# Altium schematic sheet 201944AEP4P02.SchDoc
size A4
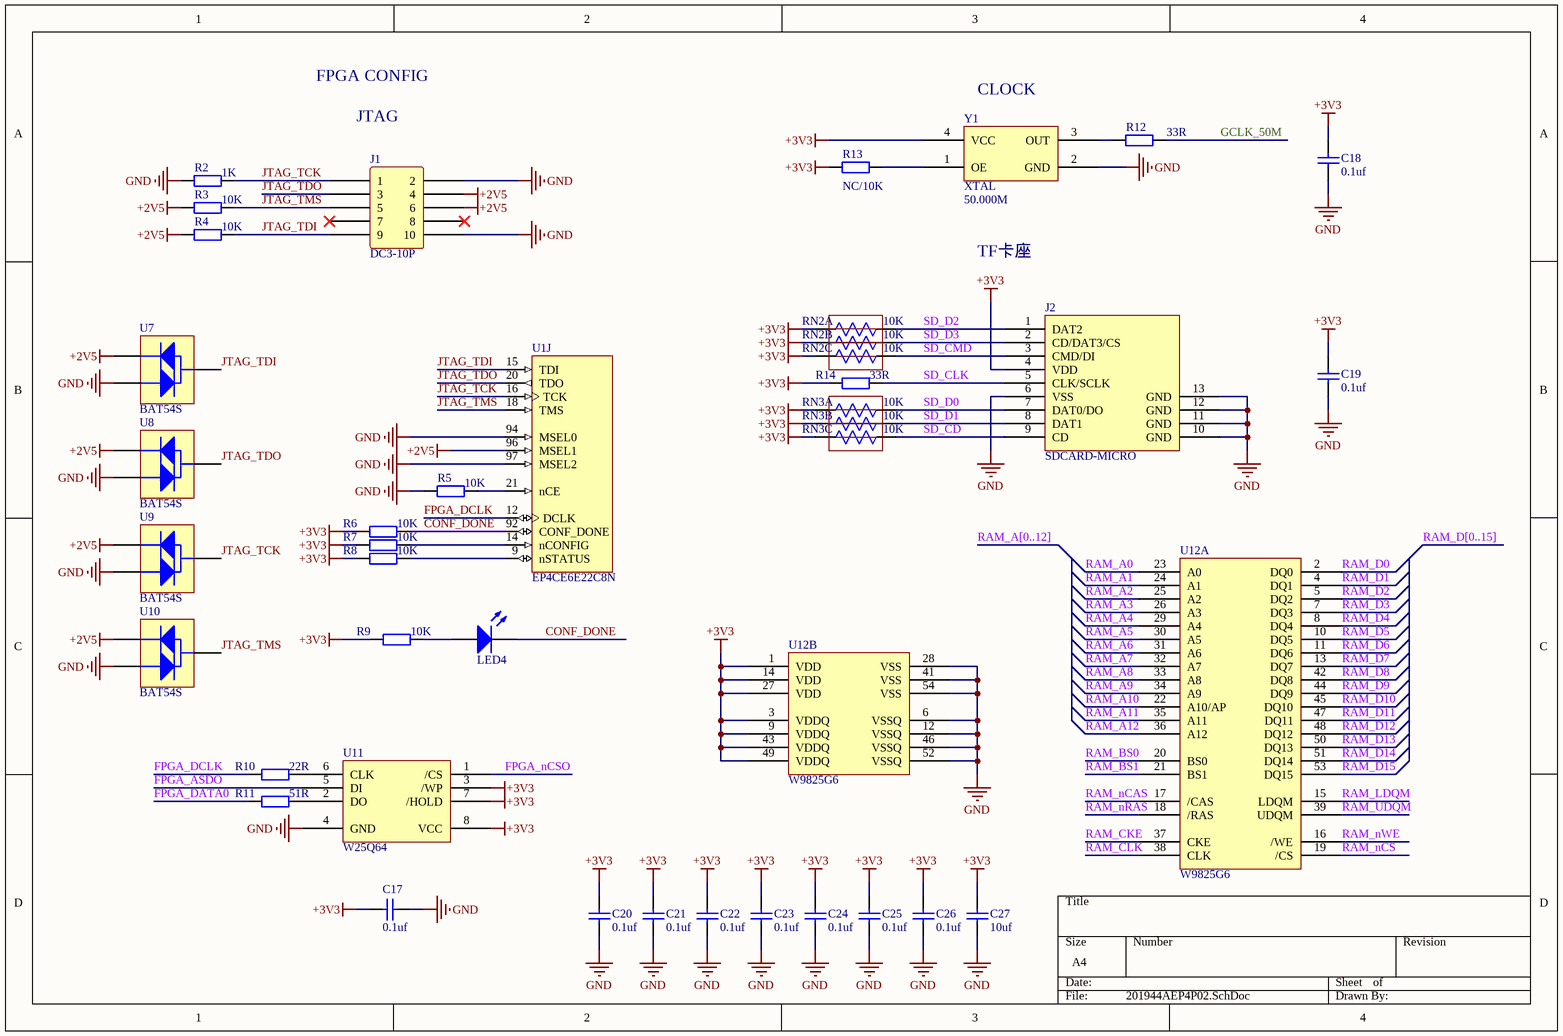
[diagram p0: 201944AEP4P02.SchDoc]

## Parts
C17  value 0.1uf  [C0805]  (hidden comment: Cap)
C18  value 0.1uf  [C0805]  (hidden comment: Cap)
C19  value 0.1uf  [C0805]  (hidden comment: Cap)
C20  value 0.1uf  [C0805]  (hidden comment: Cap)
C21  value 0.1uf  [C0805]  (hidden comment: Cap)
C22  value 0.1uf  [C0805]  (hidden comment: Cap)
C23  value 0.1uf  [C0805]  (hidden comment: Cap)
C24  value 0.1uf  [C0805]  (hidden comment: Cap)
C25  value 0.1uf  [C0805]  (hidden comment: Cap)
C26  value 0.1uf  [C0805]  (hidden comment: Cap)
C27  value 10uf  [C0805]  (hidden comment: Cap)
J1  DC3-10P  [DC3-10P]
J2  SDCARD-MICRO  [SDCARD-MICRO]
LED4  LED  [LED1206]  (value not drawn)
R2  value 1K  [R0805]  (hidden comment: Res)
R3  value 10K  [R0805]  (hidden comment: Res)
R4  value 10K  [R0805]  (hidden comment: Res)
R5  value 10K  [R0805]  (hidden comment: Res)
R6  value 10K  [R0805]  (hidden comment: Res)
R7  value 10K  [R0805]  (hidden comment: Res)
R8  value 10K  [R0805]  (hidden comment: Res)
R9  value 10K  [R0805]  (hidden comment: Res)
R10  value 22R  [R0805]  (hidden comment: Res)
R11  value 51R  [R0805]  (hidden comment: Res)
R12  value 33R  [R0805]  (hidden comment: Res)
R13  value NC/10K  [R0805]  (hidden comment: Res)
R14  value 33R  [R0805]  (hidden comment: Res)
RN2  value 10K  [RA0603]  (hidden comment: Res Array)  (parts A,B,C of 4)
RN3  value 10K  [RA0603]  (hidden comment: Res Array)  (parts A,B,C of 4)
U1  EP4CE6E22C8N  [EP4CE6E22C8N-EQFP144+]  (part J of 13)
U7  BAT54S  [BAT54S-SOT23]
U8  BAT54S  [BAT54S-SOT23]
U9  BAT54S  [BAT54S-SOT23]
U10  BAT54S  [BAT54S-SOT23]
U11  W25Q64  [W25Q64-SOIC8]
U12  W9825G6  [W9825G6-TSOP54]  (parts A,B of 2)
Y1  XTAL  value 50.000M  [XTAL-3225]

## Nets
+2V5: J1.4 J1.6 R3.1 R4.1 U1.96(MSEL1) U7.B U8.B U9.B U10.B
+3V3: C17.1 C18.1 C19.1 C20.1 C21.1 C22.1 C23.1 C24.1 C25.1 C26.1 C27.1 J2.4(VDD) R6.1 R7.1 R8.1 R9.1 R13.1 R14.1 RN2.1 RN2.2 RN2.3 RN3.1 RN3.2 RN3.3 U11.3(/WP) U11.7(/HOLD) U11.8(VCC) U12.1(VDD) U12.3(VDDQ) U12.9(VDDQ) U12.14(VDD) U12.27(VDD) U12.43(VDDQ) U12.49(VDDQ) Y1.4(VCC)
GND: C17.2 C18.2 C19.2 C20.2 C21.2 C22.2 C23.2 C24.2 C25.2 C26.2 C27.2 J1.2 J1.10 J2.6(VSS) J2.10(GND) J2.11(GND) J2.12(GND) J2.13(GND) R2.1 R5.1 U1.94(MSEL0) U1.97(MSEL2) U7.A U8.A U9.A U10.A U11.4(GND) U12.6(VSSQ) U12.12(VSSQ) U12.28(VSS) U12.41(VSS) U12.46(VSSQ) U12.52(VSSQ) U12.54(VSS) Y1.2(GND)
CONF_DONE: LED4.2(K) R6.2 U1.92(CONF_DONE)
FPGA_ASDO: U11.5(DI)
FPGA_DATA0: R11.1
FPGA_DCLK: R10.1 U1.12(DCLK)
FPGA_nCSO: U11.1(/CS)
GCLK_50M: R12.2
JTAG_TCK: J1.1 R2.2 U1.16(TCK) U9.C
JTAG_TDI: J1.9 R4.2 U1.15(TDI) U7.C
JTAG_TDO: J1.3 U1.20(TDO) U8.C
JTAG_TMS: J1.5 R3.2 U1.18(TMS) U10.C
RAM_A0: U12.23(A0)
RAM_A1: U12.24(A1)
RAM_A2: U12.25(A2)
RAM_A3: U12.26(A3)
RAM_A4: U12.29(A4)
RAM_A5: U12.30(A5)
RAM_A6: U12.31(A6)
RAM_A7: U12.32(A7)
RAM_A8: U12.33(A8)
RAM_A9: U12.34(A9)
RAM_A10: U12.22(A10/AP)
RAM_A11: U12.35(A11)
RAM_A12: U12.36(A12)
RAM_BS0: U12.20(BS0)
RAM_BS1: U12.21(BS1)
RAM_CKE: U12.37(CKE)
RAM_CLK: U12.38(CLK)
RAM_D0: U12.2(DQ0)
RAM_D1: U12.4(DQ1)
RAM_D2: U12.5(DQ2)
RAM_D3: U12.7(DQ3)
RAM_D4: U12.8(DQ4)
RAM_D5: U12.10(DQ5)
RAM_D6: U12.11(DQ6)
RAM_D7: U12.13(DQ7)
RAM_D8: U12.42(DQ8)
RAM_D9: U12.44(DQ9)
RAM_D10: U12.45(DQ10)
RAM_D11: U12.47(DQ11)
RAM_D12: U12.48(DQ12)
RAM_D13: U12.50(DQ13)
RAM_D14: U12.51(DQ14)
RAM_D15: U12.53(DQ15)
RAM_LDQM: U12.15(LDQM)
RAM_nCAS: U12.17(/CAS)
RAM_nCS: U12.19(/CS)
RAM_nRAS: U12.18(/RAS)
RAM_nWE: U12.16(/WE)
RAM_UDQM: U12.39(UDQM)
SD_CD: J2.9(CD) RN3.6
SD_CLK: J2.5(CLK/SCLK) R14.2
SD_CMD: J2.3(CMD/DI) RN2.6
SD_D0: J2.7(DAT0/DO) RN3.8
SD_D1: J2.8(DAT1) RN3.7
SD_D2: J2.1(DAT2) RN2.8
SD_D3: J2.2(CD/DAT3/CS) RN2.7
NetLED4_1: LED4.1(A) R9.2
NetR5_2: R5.2 U1.21(nCE)
NetR7_2: R7.2 U1.14(nCONFIG)
NetR8_2: R8.2 U1.9(nSTATUS)
NetR10_2: R10.2 U11.6(CLK)
NetR11_2: R11.2 U11.2(DO)
NetR12_1: R12.1 Y1.3(OUT)
NetR13_2: R13.2 Y1.1(OE)

Not connected (* = marked no-connect by the designer): J1 7* 8*

## Buses and harness runs
bus RAM_A[0..12]
bus RAM_D[0..15]

## Notes on the sheet
- FPGA CONFIG
- (near Y1) CLOCK
- JTAG
- TF卡座

## Library data of the parts
J2 = SDCARD-MICRO: Micro SD卡座
RN2 RN3 = Res Array 2: 贴片排阻
U1 = EP4CE6E22C8N: Cyclone IV Family FPGA, 1.2V Core, 91 I/O Pins, 2 PLLs, 144-Pin QFP, Speed Grade 8, Commercial Grade, Pb-Free; Manufacturer: Altera; DatasheetVersion: ver1.6, Nov-2011; PackageVersion: ver1.0, Jan-2011; PackageReference: EQFP144_A-165_D2-54; PackageDescription: 144-Pin Plastic Enhanced Quad Flat Pack (EQFP) - Wire Bond - A:1.65 - D2:5.4; Code_JEDEC: MS-026-BFB-HD; ComponentLink1Description: Manufacturer URL; ComponentLink1URL: http://www.altera.com/; ComponentLink2Description: Handbook; ComponentLink2URL: http://www.altera.com/literature/hb/cyclone-iv/cyclone4-handbook.pdf; ComponentLink3Description: Pinout; ComponentLink3URL: http://www.altera.com/literature/lit-dp.jsp?category=cyc%204&showspreadsheet=y; ComponentLink4Description: Package Specification; ComponentLink4URL: http://www.altera.com/devicepackaging/04R00402-00.pdf
U11 = W25Q64: 64M-BIT / SERIAL FLASH MEMORY WITH / DUAL, QUAD SPI; Manufacturer: Microchip; PartNumber: 24LC256-I/SN; DatasheetVersion: revP, Oct-2007; PackageVersion: revBB, Aug-2009; PackageReference: SOIC-SN8; PackageDescription: 8-Lead Plastic Small Outline (SN) - Narrow, 3.90mm Body [SOIC]; Mounting Technology: Surface Mount; Code_JEDEC: MS-012; Code_IPC: SOIC127P600-8; ComponentLink1Description: Manufacturer URL; ComponentLink1URL: http://www.microchip.com/; ComponentLink2Description: Datasheet; ComponentLink2URL: http://ww1.microchip.com/downloads/en/DeviceDoc/21203P.pdf; ComponentLink3Description: Package Specification; ComponentLink3URL: http://www.microchip.com/stellent/groups/techpub_sg/documents/packagingspec/en012702.pdf
U12 = W9825G6: 4 M * 4 BANKS * 16 BITS SDRAM
Y1 = XTAL2: 有源晶振